# EAGLE schematic 5x18 (EAGLE 6.4)
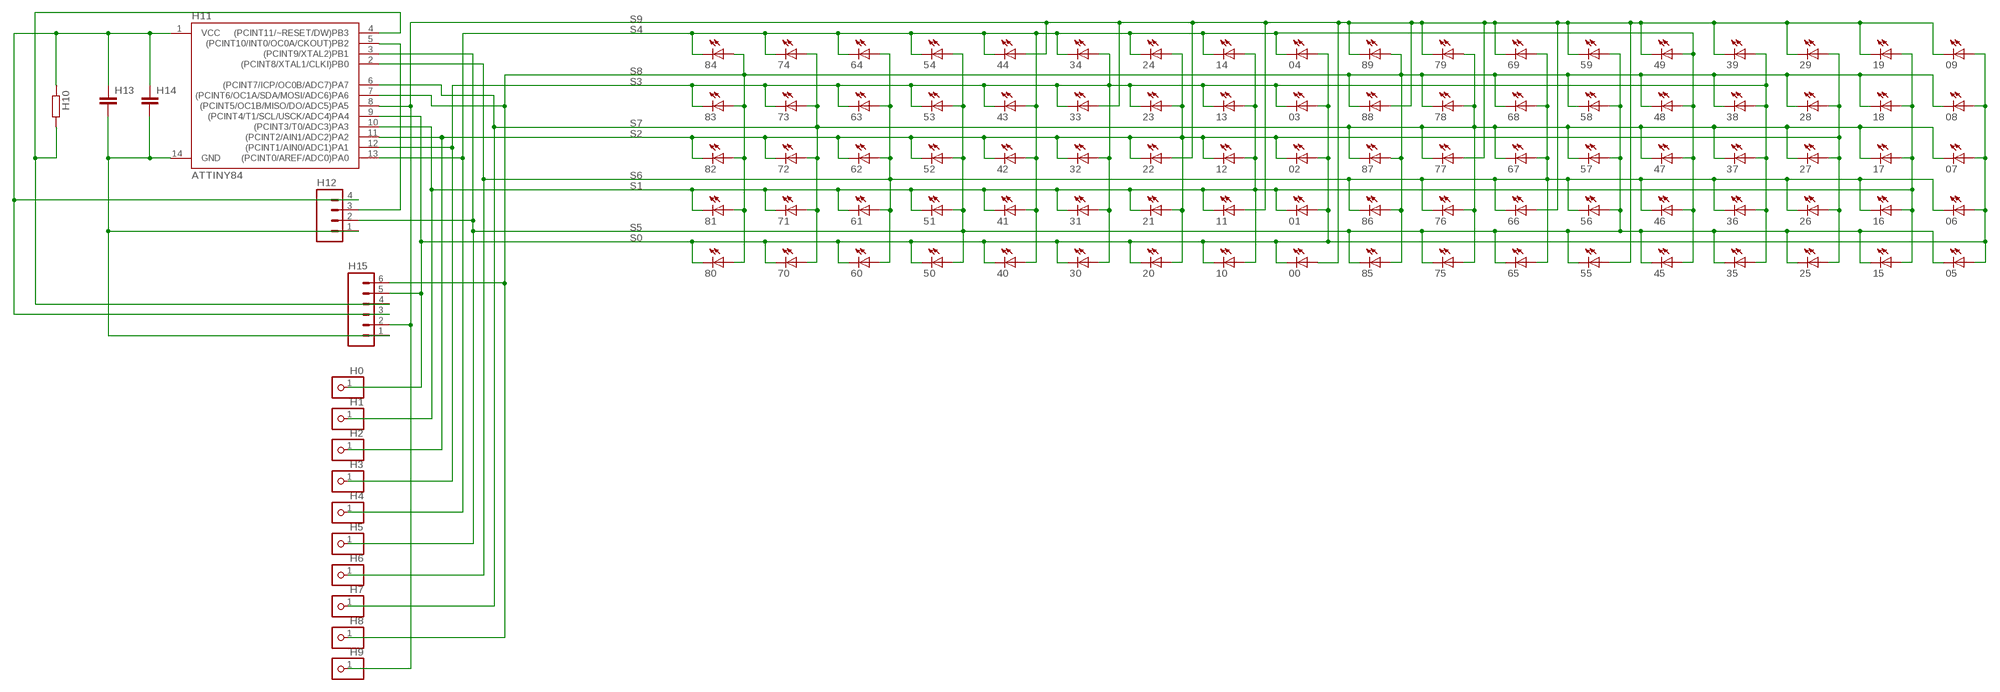
[diagram p0: schematic, sheet 1]

## Parts
00  LED3MM  [LED3MM]
01  LED3MM  [LED3MM]
02  LED3MM  [LED3MM]
03  LED3MM  [LED3MM]
04  LED3MM  [LED3MM]
05  LED3MM  [LED3MM]
06  LED3MM  [LED3MM]
07  LED3MM  [LED3MM]
08  LED3MM  [LED3MM]
09  LED3MM  [LED3MM]
10  LED3MM  [LED3MM]
11  LED3MM  [LED3MM]
12  LED3MM  [LED3MM]
13  LED3MM  [LED3MM]
14  LED3MM  [LED3MM]
15  LED3MM  [LED3MM]
16  LED3MM  [LED3MM]
17  LED3MM  [LED3MM]
18  LED3MM  [LED3MM]
19  LED3MM  [LED3MM]
20  LED3MM  [LED3MM]
21  LED3MM  [LED3MM]
22  LED3MM  [LED3MM]
23  LED3MM  [LED3MM]
24  LED3MM  [LED3MM]
25  LED3MM  [LED3MM]
26  LED3MM  [LED3MM]
27  LED3MM  [LED3MM]
28  LED3MM  [LED3MM]
29  LED3MM  [LED3MM]
30  LED3MM  [LED3MM]
31  LED3MM  [LED3MM]
32  LED3MM  [LED3MM]
33  LED3MM  [LED3MM]
34  LED3MM  [LED3MM]
35  LED3MM  [LED3MM]
36  LED3MM  [LED3MM]
37  LED3MM  [LED3MM]
38  LED3MM  [LED3MM]
39  LED3MM  [LED3MM]
40  LED3MM  [LED3MM]
41  LED3MM  [LED3MM]
42  LED3MM  [LED3MM]
43  LED3MM  [LED3MM]
44  LED3MM  [LED3MM]
45  LED3MM  [LED3MM]
46  LED3MM  [LED3MM]
47  LED3MM  [LED3MM]
48  LED3MM  [LED3MM]
49  LED3MM  [LED3MM]
50  LED3MM  [LED3MM]
51  LED3MM  [LED3MM]
52  LED3MM  [LED3MM]
53  LED3MM  [LED3MM]
54  LED3MM  [LED3MM]
55  LED3MM  [LED3MM]
56  LED3MM  [LED3MM]
57  LED3MM  [LED3MM]
58  LED3MM  [LED3MM]
59  LED3MM  [LED3MM]
60  LED3MM  [LED3MM]
61  LED3MM  [LED3MM]
62  LED3MM  [LED3MM]
63  LED3MM  [LED3MM]
64  LED3MM  [LED3MM]
65  LED3MM  [LED3MM]
66  LED3MM  [LED3MM]
67  LED3MM  [LED3MM]
68  LED3MM  [LED3MM]
69  LED3MM  [LED3MM]
70  LED3MM  [LED3MM]
71  LED3MM  [LED3MM]
72  LED3MM  [LED3MM]
73  LED3MM  [LED3MM]
74  LED3MM  [LED3MM]
75  LED3MM  [LED3MM]
76  LED3MM  [LED3MM]
77  LED3MM  [LED3MM]
78  LED3MM  [LED3MM]
79  LED3MM  [LED3MM]
80  LED3MM  [LED3MM]
81  LED3MM  [LED3MM]
82  LED3MM  [LED3MM]
83  LED3MM  [LED3MM]
84  LED3MM  [LED3MM]
85  LED3MM  [LED3MM]
86  LED3MM  [LED3MM]
87  LED3MM  [LED3MM]
88  LED3MM  [LED3MM]
89  LED3MM  [LED3MM]
H0  PINHD-1X1  [1X01]
H1  PINHD-1X1  [1X01]
H2  PINHD-1X1  [1X01]
H3  PINHD-1X1  [1X01]
H4  PINHD-1X1  [1X01]
H5  PINHD-1X1  [1X01]
H6  PINHD-1X1  [1X01]
H7  PINHD-1X1  [1X01]
H8  PINHD-1X1  [1X01]
H9  PINHD-1X1  [1X01]
H10  R-EU_0204/7  [0204/7]
H11  ATTINY84  [SO14]
H12  M04LOCK  [1X04_LOCK]
H13  C-EU050-025X075  [C050-025X075]
H14  C-EU050-025X075  [C050-025X075]
H15  M06LOCK  [1X06_LOCK]

## Nets
S0: 00.K(C) 01.A 02.A 03.A 04.A 05.A 06.A 07.A 08.A 09.A 10.K(C) 20.K(C) 30.K(C) 40.K(C) 50.K(C) 60.K(C) 70.K(C) 80.K(C) H0.1 H11.9((PCINT4/T1/SCL/USCK/ADC4)PA4) H15.5
S1: 01.K(C) 10.A 11.K(C) 12.A 13.A 14.A 15.A 16.A 17.A 18.A 19.A 21.K(C) 31.K(C) 41.K(C) 51.K(C) 61.K(C) 71.K(C) 81.K(C) H1.1 H11.10((PCINT3/T0/ADC3)PA3)
S2: 02.K(C) 12.K(C) 20.A 21.A 22.K(C) 23.A 24.A 25.A 26.A 27.A 28.A 29.A 32.K(C) 42.K(C) 52.K(C) 62.K(C) 72.K(C) 82.K(C) H2.1 H11.11((PCINT2/AIN1/ADC2)PA2)
S3: 03.K(C) 13.K(C) 23.K(C) 30.A 31.A 32.A 33.K(C) 34.A 35.A 36.A 37.A 38.A 39.A 43.K(C) 53.K(C) 63.K(C) 73.K(C) 83.K(C) H3.1 H11.12((PCINT1/AIN0/ADC1)PA1)
S4: 04.K(C) 14.K(C) 24.K(C) 34.K(C) 40.A 41.A 42.A 43.A 44.K(C) 45.A 46.A 47.A 48.A 49.A 54.K(C) 64.K(C) 74.K(C) 84.K(C) H4.1 H11.13((PCINT0/AREF/ADC0)PA0)
S5: 05.K(C) 15.K(C) 25.K(C) 35.K(C) 45.K(C) 50.A 51.A 52.A 53.A 54.A 55.K(C) 56.A 57.A 58.A 59.A 65.K(C) 75.K(C) 85.K(C) H5.1 H11.3((PCINT9/XTAL2)PB1) H12.2
S6: 06.K(C) 16.K(C) 26.K(C) 36.K(C) 46.K(C) 56.K(C) 60.A 61.A 62.A 63.A 64.A 65.A 66.K(C) 67.A 68.A 69.A 76.K(C) 86.K(C) H6.1 H11.2((PCINT8/XTAL1/CLKI)PB0)
S7: 07.K(C) 17.K(C) 27.K(C) 37.K(C) 47.K(C) 57.K(C) 67.K(C) 70.A 71.A 72.A 73.A 74.A 75.A 76.A 77.K(C) 78.A 79.A 87.K(C) H7.1 H11.6((PCINT7/ICP/OC0B/ADC7)PA7)
S8: 08.K(C) 18.K(C) 28.K(C) 38.K(C) 48.K(C) 58.K(C) 68.K(C) 78.K(C) 80.A 81.A 82.A 83.A 84.A 85.A 86.A 87.A 88.K(C) 89.A H8.1 H11.7((PCINT6/OC1A/SDA/MOSI/ADC6)PA6) H15.6
S9: 00.A 09.K(C) 11.A 19.K(C) 22.A 29.K(C) 33.A 39.K(C) 44.A 49.K(C) 55.A 59.K(C) 66.A 69.K(C) 77.A 79.K(C) 88.A 89.K(C) H9.1 H11.8((PCINT5/OC1B/MISO/DO/ADC5)PA5) H15.2
S$1: H10.1 H11.1(VCC) H12.4 H13.1 H14.1 H15.3
S$2: H10.2 H11.4((PCINT11/~RESET/DW)PB3) H15.4
S$3: H11.14(GND) H12.1 H13.2 H14.2 H15.1
S$4: H11.5((PCINT10/INT0/OC0A/CKOUT)PB2) H12.3

## Library data of the parts
00 01-09 10-89 = led:LED: LED OSRAM: - CHIPLED LG R971, LG N971, LY N971, LG Q971, LY Q971, LO R971, LY R971 LH N974, LH R974 LS Q976, LO Q976, LY Q976 LO Q996 - Hyper CHIPLED LW Q18S LB Q993, LB Q99A, LB R99A - SideLED LS A670, LO A670, LY A670, LG A670, LP A670 LB A673, LV A673, LT A673, LW A673 LH A674 LY A675 LS A676, LA A676, LO A676, LY A676, LW A676 LS A679, LY A679, LG A679 - Hyper Micro SIDELED® LS Y876, LA Y876, LO Y876, LY Y876 LT Y87S - SmartLED LW L88C, LW L88S LB L89C, LB L89S, LG L890 LS L89K, LO L89K, LY L89K LS L896, LA L896, LO L896, LY L896 - TOPLED LS T670, LO T670, LY T670, LG T670, LP T670 LSG T670, LSP T670, LSY T670, LOP T670, LYG T670 LG T671, LOG T671, LSG T671 LB T673, LV T673, LT T673, LW T673 LH T674 LS T676, LA T676, LO T676, LY T676, LB T676, LH T676, LSB T676, LW T676 LB T67C, LV T67C, LT T67C, LS T67K, LO T67K, LY T67K, LW E67C LS E67B, LA E67B, LO E67B, LY E67B, LB E67C, LV E67C, LT E67C LW T67C LS T679, LY T679, LG T679 LS T770, LO T770, LY T770, LG T770, LP T770 LB T773, LV T773, LT T773, LW T773 LH T774 LS E675, LA E675, LY E675, LS T675 LS T776, LA T776, LO T776, LY T776, LB T776 LHGB T686 LT T68C, LB T68C - Hyper Mini TOPLED® LB M676 - Mini TOPLED Santana® LG M470 LS M47K, LO M47K, LY M47K Source: http://www.osram.convergy.de LUXEON: - LUMILED® LXK2-PW12-R00, LXK2-PW12-S00, LXK2-PW14-U00, LXK2-PW14-V00 LXK2-PM12-R00, LXK2-PM12-S00, LXK2-PM14-U00 LXK2-PE12-Q00, LXK2-PE12-R00, LXK2-PE12-S00, LXK2-PE14-T00, LXK2-PE14-U00 LXK2-PB12-K00, LXK2-PB12-L00, LXK2-PB12-M00, LXK2-PB14-N00, LXK2-PB14-P00, LXK2-PB14-Q00 LXK2-PR12-L00, LXK2-PR12-M00, LXK2-PR14-Q00, LXK2-PR14-R00 LXK2-PD12-Q00, LXK2-PD12-R00, LXK2-PD12-S00 LXK2-PH12-R00, LXK2-PH12-S00 LXK2-PL12-P00, LXK2-PL12-Q00, LXK2-PL12-R00 Source: www.luxeon.com KINGBRIGHT: KA-3528ASYC Source: www.kingbright.com
H0 H1-H9 = pinhead:PINHD-1X1: PIN HEADER
H10 = rcl:R-EU_: RESISTOR, European symbol
H11 = SparkFun-DigitalIC:ATTINY84: Atmel 14-pin 2/4/8kB flash uC
H12 = SparkFun-Connectors:M04: Header 4 Standard 4-pin 0.1" header. Use with straight break away headers (SKU : PRT-00116), right angle break away headers (PRT-00553), swiss pins (PRT-00743), machine pins (PRT-00117), and female headers (PRT-00115). Molex polarized connector foot print use with SKU : PRT-08231 with associated crimp pins and housings. 1MM SMD Version SKU: PRT-10208
H13 H14 = rcl:C-EU: CAPACITOR, European symbol
H15 = SparkFun-Connectors:M06: Header 6 Standard 6-pin 0.1" header. Use with straight break away headers (SKU : PRT-00116), right angle break away headers (PRT-00553), swiss pins (PRT-00743), machine pins (PRT-00117), and female headers (PRT-00115). Molex polarized connector foot print use with SKU : PRT-08094 with associated crimp pins and housings. NOTES ON THE VARIANTS LOCK and LOCK_LONGPADS... This footprint was designed to help hold the alignment of a through-hole component (i.e. 6-pin header) while soldering it into place. You may notice that each hole has been shifted either up or down by 0.005 of an inch from it's more standard position (which is a perfectly straight line). This slight alteration caused the pins (the squares in the middle) to touch the edges of the holes. Because they are alternating, it causes a "brace" to hold the component in place. 0.005 has proven to be the perfect amount of "off-center" position when using our standard breakaway headers. Although looks a little odd when you look at the bare footprint, once you have a header in there, the alteration is very hard to notice. Also, if you push a header all the way into place, it is covered up entirely on the bottom side. This idea of altering the position of holes to aid alignment will be further integrated into the Sparkfun Library for other footprints. It can help hold any component with 3 or more connection pins.